# Altium schematic sheet 4_IO.SCHDOC
size 297 x 209 mm; SheetNumber: 16; SheetTotal: 18; DocumentName: 4_IO.SCHDOC
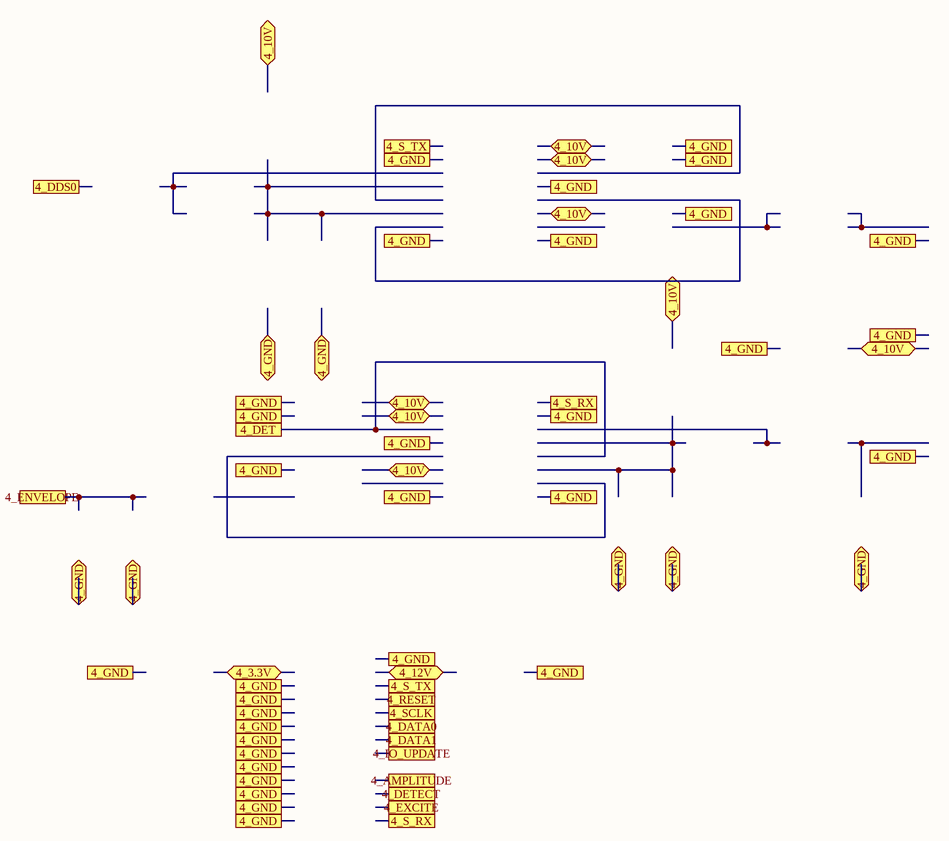
[diagram p0: 4_IO.SCHDOC]

## Ports
4_3.3V (bidir), 4_10V, 4_10V (bidir), 4_12V (bidir), 4_AMPLITUDE, 4_DATA0, 4_DATA1, 4_DDS0, 4_DET, 4_DETECT, 4_ENVELOPE, 4_EXCITE, 4_GND, 4_IO_UPDATE, 4_RESET, 4_S_RX, 4_S_TX, 4_SCLK

## Notes on the sheet
- A
- B
- C
- D
- 1
- 2
- 3
- Title
- 4
- Size
- A4
- Number
- Rev
- Date
- Filename
- Drawn by
- Sheet
- of